# Altium project Connector4Stepper.PrjPcb
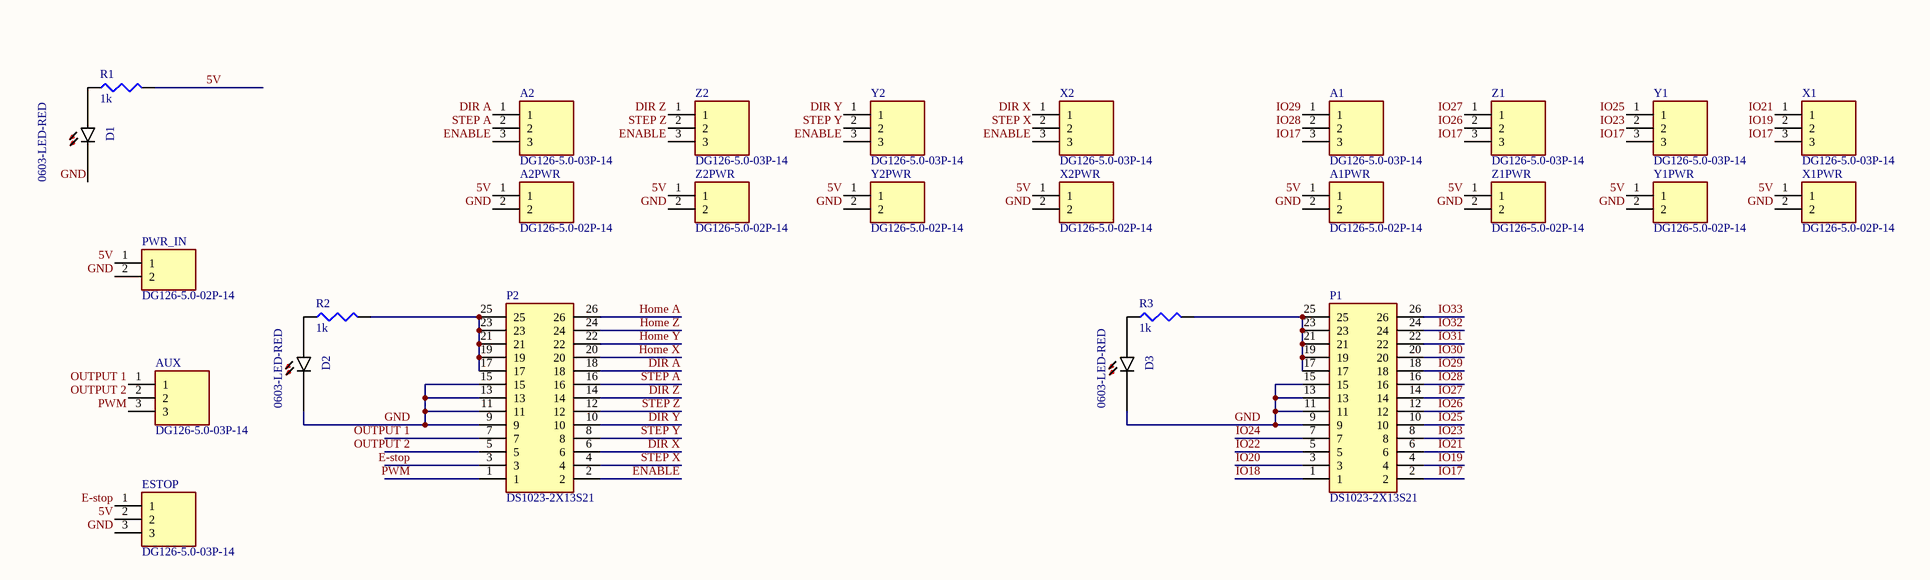
[diagram p0: SCH.SchDoc]
Version: 3.0.0
1 sheet, 27 parts. Net scope: global (net labels, ports and power ports of the same name join across sheets).
Board file: PCB.PcbDoc

## Sheet SCH.SchDoc
size A3; Revision: 10

### Parts
A1  DG126-5.0-03P-14  [DG1265003P1400AH]
A1PWR  DG126-5.0-02P-14  [DG1265002P1400AH]
A2  DG126-5.0-03P-14  [DG1265003P1400AH]
A2PWR  DG126-5.0-02P-14  [DG1265002P1400AH]
AUX  DG126-5.0-03P-14  [DG1265003P1400AH]
D1  0603-LED-RED  [*LEDM1608X80_LTE-C1906R-14(Primary)]
D2  0603-LED-RED  [*LEDM1608X80_LTE-C1906R-14(Primary)]
D3  0603-LED-RED  [*LEDM1608X80_LTE-C1906R-14(Primary)]
ESTOP  DG126-5.0-03P-14  [DG1265003P1400AH]
P1  DS1023-2X13S21  [DS10232X13S21]
P2  DS1023-2X13S21  [DS10232X13S21]
PWR_IN  DG126-5.0-02P-14  [DG1265002P1400AH]
R1  value 1k  [J1-0603]  (hidden comment: RC0603FR-071KL)
R2  value 1k  [J1-0603]  (hidden comment: RC0603FR-071KL)
R3  value 1k  [J1-0603]  (hidden comment: RC0603FR-071KL)
X1  DG126-5.0-03P-14  [DG1265003P1400AH]
X1PWR  DG126-5.0-02P-14  [DG1265002P1400AH]
X2  DG126-5.0-03P-14  [DG1265003P1400AH]
X2PWR  DG126-5.0-02P-14  [DG1265002P1400AH]
Y1  DG126-5.0-03P-14  [DG1265003P1400AH]
Y1PWR  DG126-5.0-02P-14  [DG1265002P1400AH]
Y2  DG126-5.0-03P-14  [DG1265003P1400AH]
Y2PWR  DG126-5.0-02P-14  [DG1265002P1400AH]
Z1  DG126-5.0-03P-14  [DG1265003P1400AH]
Z1PWR  DG126-5.0-02P-14  [DG1265002P1400AH]
Z2  DG126-5.0-03P-14  [DG1265003P1400AH]
Z2PWR  DG126-5.0-02P-14  [DG1265002P1400AH]

### Nets
5V: A1PWR.1 A2PWR.1 ESTOP.2 PWR_IN.1 R1.2 X1PWR.1 X2PWR.1 Y1PWR.1 Y2PWR.1 Z1PWR.1 Z2PWR.1
DIR A: A2.1 P2.18
DIR X: P2.6 X2.1
DIR Y: P2.10 Y2.1
DIR Z: P2.14 Z2.1
E-stop: ESTOP.1 P2.3
ENABLE: A2.3 P2.2 X2.3 Y2.3 Z2.3
GND: A1PWR.2 A2PWR.2 D1.C D2.C D3.C ESTOP.3 P1.9 P1.11 P1.13 P1.15 P2.9 P2.11 P2.13 P2.15 PWR_IN.2 X1PWR.2 X2PWR.2 Y1PWR.2 Y2PWR.2 Z1PWR.2 Z2PWR.2
Home A: P2.26
Home X: P2.20
Home Y: P2.22
Home Z: P2.24
IO17: A1.3 P1.2 X1.3 Y1.3 Z1.3
IO18: P1.1
IO19: P1.4 X1.2
IO20: P1.3
IO21: P1.6 X1.1
IO22: P1.5
IO23: P1.8 Y1.2
IO24: P1.7
IO25: P1.10 Y1.1
IO26: P1.12 Z1.2
IO27: P1.14 Z1.1
IO28: A1.2 P1.16
IO29: A1.1 P1.18
IO30: P1.20
IO31: P1.22
IO32: P1.24
IO33: P1.26
OUTPUT 1: AUX.1 P2.7
OUTPUT 2: AUX.2 P2.5
PWM: AUX.3 P2.1
STEP A: A2.2 P2.16
STEP X: P2.4 X2.2
STEP Y: P2.8 Y2.2
STEP Z: P2.12 Z2.2
NetD1_A: D1.A R1.1
NetD2_A: D2.A R2.1
NetD3_A: D3.A R3.1
NetP1_17: P1.17 P1.19 P1.21 P1.23 P1.25 R3.2
NetP2_17: P2.17 P2.19 P2.21 P2.23 P2.25 R2.2

### Library data of the parts
A1 A2 AUX ESTOP X1 X2 Y1 Y2 Z1 Z2 = DG126-5.0-03P-14-00AH: Connector; Manufacturer_Name: Degson; Height: 10.9mm; Manufacturer_Part_Number: DG126-5.0-03P-14; HelpURL: https://static.chipdip.ru/lib/309/DOC000309400.pdf; ChipDip_Link: https://www.chipdip.ru/product/dg126-5.0-03p-14
A1PWR A2PWR PWR_IN X1PWR X2PWR Y1PWR Y2PWR Z1PWR Z2PWR = DG126-5.0-02P-14-00AH: Connector; Manufacturer_Name: Degson; Datasheet Link: https://asset.conrad.com/media10/add/160267/c1/-/en/001327203DS01/datasheet-1327203-degson-dg126-50-02p-14-00ah-1-screw-terminal-2-mm-number-of-pins-2-green-1-pcs.pdf; Height: 10.4mm; Manufacturer_Part_Number: DG126-5.0-02P-14; ChipDip_Link: https://www.chipdip.ru/product/dg126-5.0-02p-14; HelpURL: https://static.chipdip.ru/lib/309/DOC000309400.pdf
D1-D3 = 0603-LED-RED: Red 620nm LED Indication - Discrete 2.2V 0603 (1608 Metric); MP: LTST-C194KRKT or SML-D12U1WT86; Type: SMD; Package: 0603 Lite-On; SnapEDA_Link: https://www.snapeda.com/parts/LTE-C1906R-14/Lite-On%20Inc./view-part/?ref=snap; Value: *
P1 P2 = DS1023-2X13S21: Connector; Manufacturer_Name: CONNFLY Elec; Datasheet Link: http://www.connfly.com/static/upload/file/pdf/DS1023.pdf; Height: 8.88mm; Manufacturer_Part_Number: DS1023-2X13S21; ChipDip_Link: https://www.chipdip.ru/product/pbd-26; HelpURL: https://static.chipdip.ru/lib/095/DOC006095303.pdf
R1-R3 = RC0603FR-071KL: 1 kOhms ±1% 0.1W, 1/10W Chip Resistor 0603 (1608 Metric) Moisture Resistant Thick Film; MF: Yageo or NXP; HelpURL: https://www.yageo.com/upload/media/product/productsearch/datasheet/rchip/PYu-RC_Group_51_RoHS_L_10.pdf; MP: RC0603FR-071KL; Package: R0603; SnapEDA_Link: https://www.snapeda.com/parts/RC0603FR-101KL/Yageo/view-part/?ref=search&t=RC0603FR-07%201k; Type: SMD